# EAGLE design plugV17-Add-Large-Cap-to-support-RELAY-smd-5x5cm-side-button (EAGLE 7.6.0)
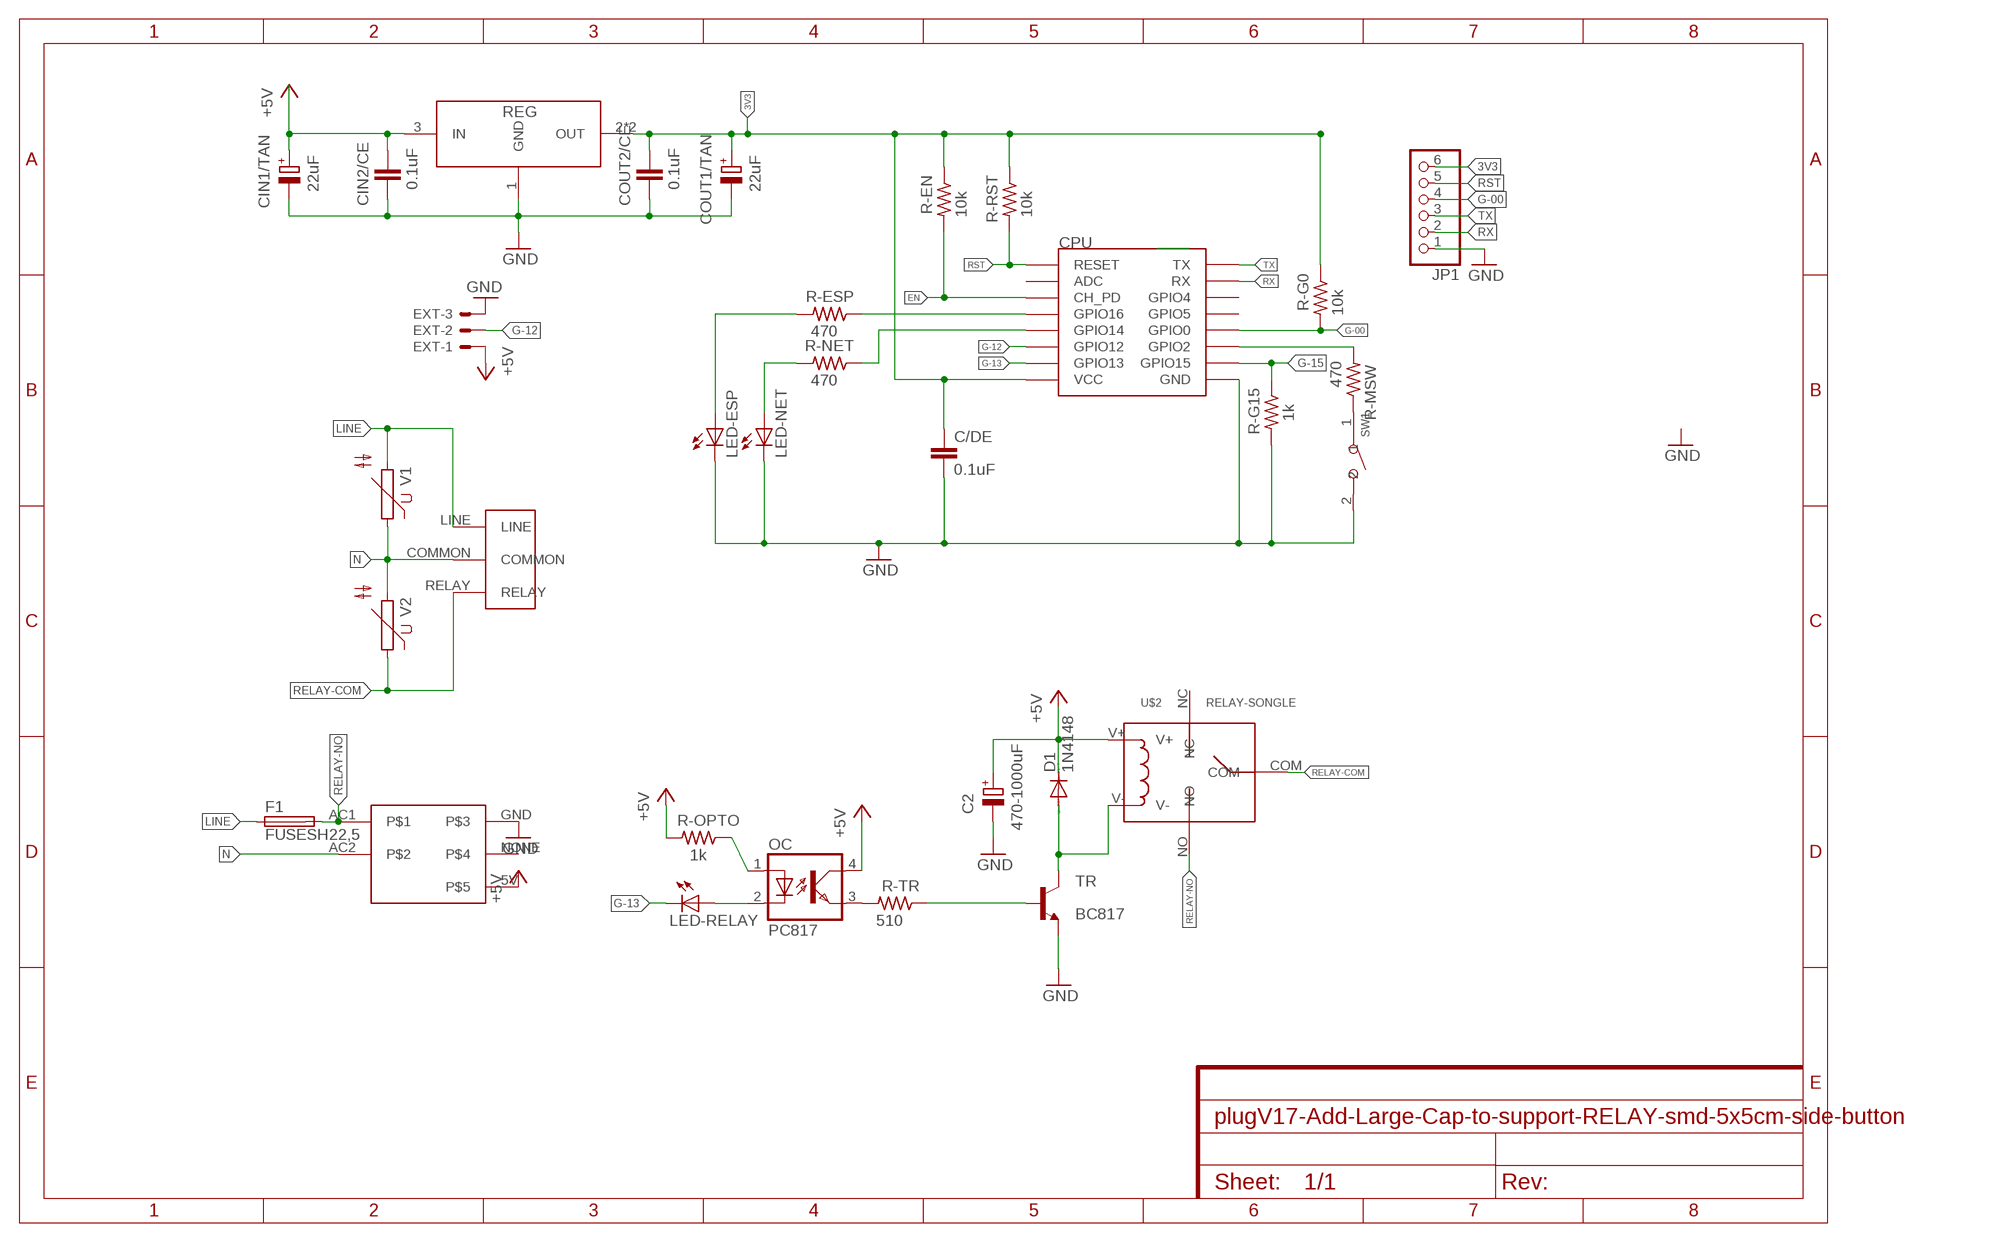
[diagram p0: schematic, sheet 1]

## Parts
C2  470-1000uF  CPOL-EUE3.5-8  [E3,5-8]
C/DE  0.1uF  C-EUC0805  [C0805]
CIN1/TAN  22uF  CPOL-EUB/3528-21R  [B/3528-21R]
CIN2/CE  0.1uF  C-EUC0805K  [C0805K]
COUT1/TAN  22uF  CPOL-EUB/3528-21R  [B/3528-21R]
COUT2/CE  0.1uF  C-EUC0805K  [C0805K]
CPU  ESP12SMD  [ESP12-SMD]
D1  1N4148  1N4148DO35-7  [DO35-7]
EXT  53048-03  [53048-03]
F1  FUSESH22,5  [SH22,5]
JP1  PINHD-1X6  [1X06]
LED-ESP  LEDCHIPLED_0805  [CHIPLED_0805]
LED-NET  LEDCHIPLED_0805  [CHIPLED_0805]
LED-RELAY  LEDCHIPLED_0805  [CHIPLED_0805]
OC  PC817  [DIL04]
R-EN  10k  R-US_M0805  [M0805]
R-ESP  470  R-US_M0805  [M0805]
R-G0  10k  R-US_M0805  [M0805]
R-G15  1k  R-US_M0805  [M0805]
R-MSW  470  R-US_M0805  [M0805]
R-NET  470  R-US_M0805  [M0805]
R-OPTO  1k  R-US_M0805  [M0805]
R-RST  10k  R-US_M0805  [M0805]
R-TR  510  R-US_M0805  [M0805]
REG  AMS1117-3.3  [SOT-223]
SW1  DIP-BUTTON(2P-6.0X3.0X4.3MM)-TS-1101F  [SW2-5.0-6.0X3.0X4.3MM]
TR  BC817  BC817-16SMD  [SOT23-BEC]
U$1  POWER-RELAY-FOOTPRINT  [POWER-RELAY-FOOTPRINT]
U$2  RELAY-SONGLE  [RELAY-SONGLE]
U$4  POWERSUPPLY-5V-700MA  [POWERSUPPLY-5V-700MA]
V1  S14K11  [S14K11]
V2  S14K11  [S14K11]

## Nets
3V3: C/DE.1 COUT1/TAN.+ COUT2/CE.1 CPU.VCC JP1.6 R-EN.1 R-G0.1 R-RST.1 REG.2(OUT) REG.4(OUT)
+5V: C2.+ CIN1/TAN.+ CIN2/CE.1 D1.C EXT.1 OC.4(COL) R-OPTO.2 REG.3(IN) U$2.V+ U$4.5V
EN: CPU.CH_PD R-EN.2
G-00: CPU.GPIO0 JP1.4 R-G0.2
G-12: CPU.GPIO12 EXT.2
G-13: CPU.GPIO13 LED-RELAY.C
G-15: CPU.GPIO15 R-G15.1
GND: C2.- C/DE.2 CIN1/TAN.- CIN2/CE.2 COUT1/TAN.- COUT2/CE.2 CPU.GND EXT.3 JP1.1 LED-ESP.C LED-NET.C R-G15.2 REG.1(GND) SW1.2 TR.E U$4.GND
LINE: F1.1 U$1.LINE V1.2
N: U$1.COMMON U$4.AC2 V1.1 V2.2
N$1: OC.3(EMIT) R-TR.2
N$2: R-TR.1 TR.B
N$6: LED-ESP.A R-ESP.2
N$7: CPU.GPIO2 R-MSW.2
N$8: CPU.GPIO14 R-NET.1
N$13: OC.1(A) R-OPTO.1
N$16: LED-NET.A R-NET.2
N$17: D1.A TR.C U$2.V-
N$19: CPU.GPIO16 R-ESP.1
N$21: LED-RELAY.A OC.2(C)
N$22: R-MSW.1 SW1.1
RELAY-COM: U$1.RELAY U$2.COM V2.1
RELAY-NO: F1.2 U$2.NO U$4.AC1
RST: CPU.RESET JP1.5 R-RST.2
RX: CPU.RXD0(RX) JP1.2
TX: CPU.TXD0(TX) JP1.3
Unconnected: CPU.ADC CPU.GPIO4 CPU.GPIO5 U$2.NC U$4.NONE

## Library data of the parts
C2 CIN1/TAN COUT1/TAN = rcl:CPOL-EU: POLARIZED CAPACITOR, European symbol
C/DE CIN2/CE COUT2/CE = rcl:C-EU: CAPACITOR, European symbol
CPU = esp8266modules:ESP12: ESP8266 Wifi module 12
D1 = diode:1N4148: DIODE high speed (Philips)
EXT = con-molex:53?-03: CONNECTOR wire to board 1.25 mm (.049 inch) pitch header; MF: WALDOM/MOLEX; MPN: 53048-0310; OC_FARNELL: 9732918; OC_NEWARK: 38C9908
F1 = fuse:FUSE: Fuse; OC_FARNELL: unknown; OC_NEWARK: unknown
JP1 = pinhead:PINHD-1X6: PIN HEADER
LED-ESP LED-NET LED-RELAY = led:LED: LED OSRAM: - CHIPLED LG R971, LG N971, LY N971, LG Q971, LY Q971, LO R971, LY R971 LH N974, LH R974 LS Q976, LO Q976, LY Q976 LO Q996 - Hyper CHIPLED LW Q18S LB Q993, LB Q99A, LB R99A - SideLED LS A670, LO A670, LY A670, LG A670, LP A670 LB A673, LV A673, LT A673, LW A673 LH A674 LY A675 LS A676, LA A676, LO A676, LY A676, LW A676 LS A679, LY A679, LG A679 - Hyper Micro SIDELED® LS Y876, LA Y876, LO Y876, LY Y876 LT Y87S - SmartLED LW L88C, LW L88S LB L89C, LB L89S, LG L890 LS L89K, LO L89K, LY L89K LS L896, LA L896, LO L896, LY L896 - TOPLED LS T670, LO T670, LY T670, LG T670, LP T670 LSG T670, LSP T670, LSY T670, LOP T670, LYG T670 LG T671, LOG T671, LSG T671 LB T673, LV T673, LT T673, LW T673 LH T674 LS T676, LA T676, LO T676, LY T676, LB T676, LH T676, LSB T676, LW T676 LB T67C, LV T67C, LT T67C, LS T67K, LO T67K, LY T67K, LW E67C LS E67B, LA E67B, LO E67B, LY E67B, LB E67C, LV E67C, LT E67C LW T67C LS T679, LY T679, LG T679 LS T770, LO T770, LY T770, LG T770, LP T770 LB T773, LV T773, LT T773, LW T773 LH T774 LS E675, LA E675, LY E675, LS T675 LS T776, LA T776, LO T776, LY T776, LB T776 LHGB T686 LT T68C, LB T68C - Hyper Mini TOPLED® LB M676 - Mini TOPLED Santana® LG M470 LS M47K, LO M47K, LY M47K Source: http://www.osram.convergy.de LUXEON: - LUMILED® LXK2-PW12-R00, LXK2-PW12-S00, LXK2-PW14-U00, LXK2-PW14-V00 LXK2-PM12-R00, LXK2-PM12-S00, LXK2-PM14-U00 LXK2-PE12-Q00, LXK2-PE12-R00, LXK2-PE12-S00, LXK2-PE14-T00, LXK2-PE14-U00 LXK2-PB12-K00, LXK2-PB12-L00, LXK2-PB12-M00, LXK2-PB14-N00, LXK2-PB14-P00, LXK2-PB14-Q00 LXK2-PR12-L00, LXK2-PR12-M00, LXK2-PR14-Q00, LXK2-PR14-R00 LXK2-PD12-Q00, LXK2-PD12-R00, LXK2-PD12-S00 LXK2-PH12-R00, LXK2-PH12-S00 LXK2-PL12-P00, LXK2-PL12-Q00, LXK2-PL12-R00 Source: www.luxeon.com KINGBRIGHT: KA-3528ASYC Source: www.kingbright.com
OC = optocoupler:PC817: SHARP OPTO COUPLER; MPN: PC817X4J000F; OC_FARNELL: 9707727; OC_NEWARK: 97K7059
R-EN R-ESP R-G0 R-G15 R-MSW R-NET R-OPTO R-RST R-TR = rcl:R-US_: RESISTOR, American symbol
REG = AMS1117-3.3:AMS1117-3.3: 1A LOW DROPOUT VOLTAGE REGULATOR
SW1 = Seeed-OPL-Switch:DIP-BUTTON(2P-6.0X3.0X4.3MM): 311020025
TR = transistor-npn:BC817*: NPN Transistor
U$1 = Power-Plug-Footprint:POWER-RELAY-FOOTPRINT
U$2 = Relay-Songle:RELAY-SONGLE
U$4 = PowerSupply-5V-700mA:POWERSUPPLY-5V-700MA
V1 V2 = varistor:S14K11: VARISTOR

## Board
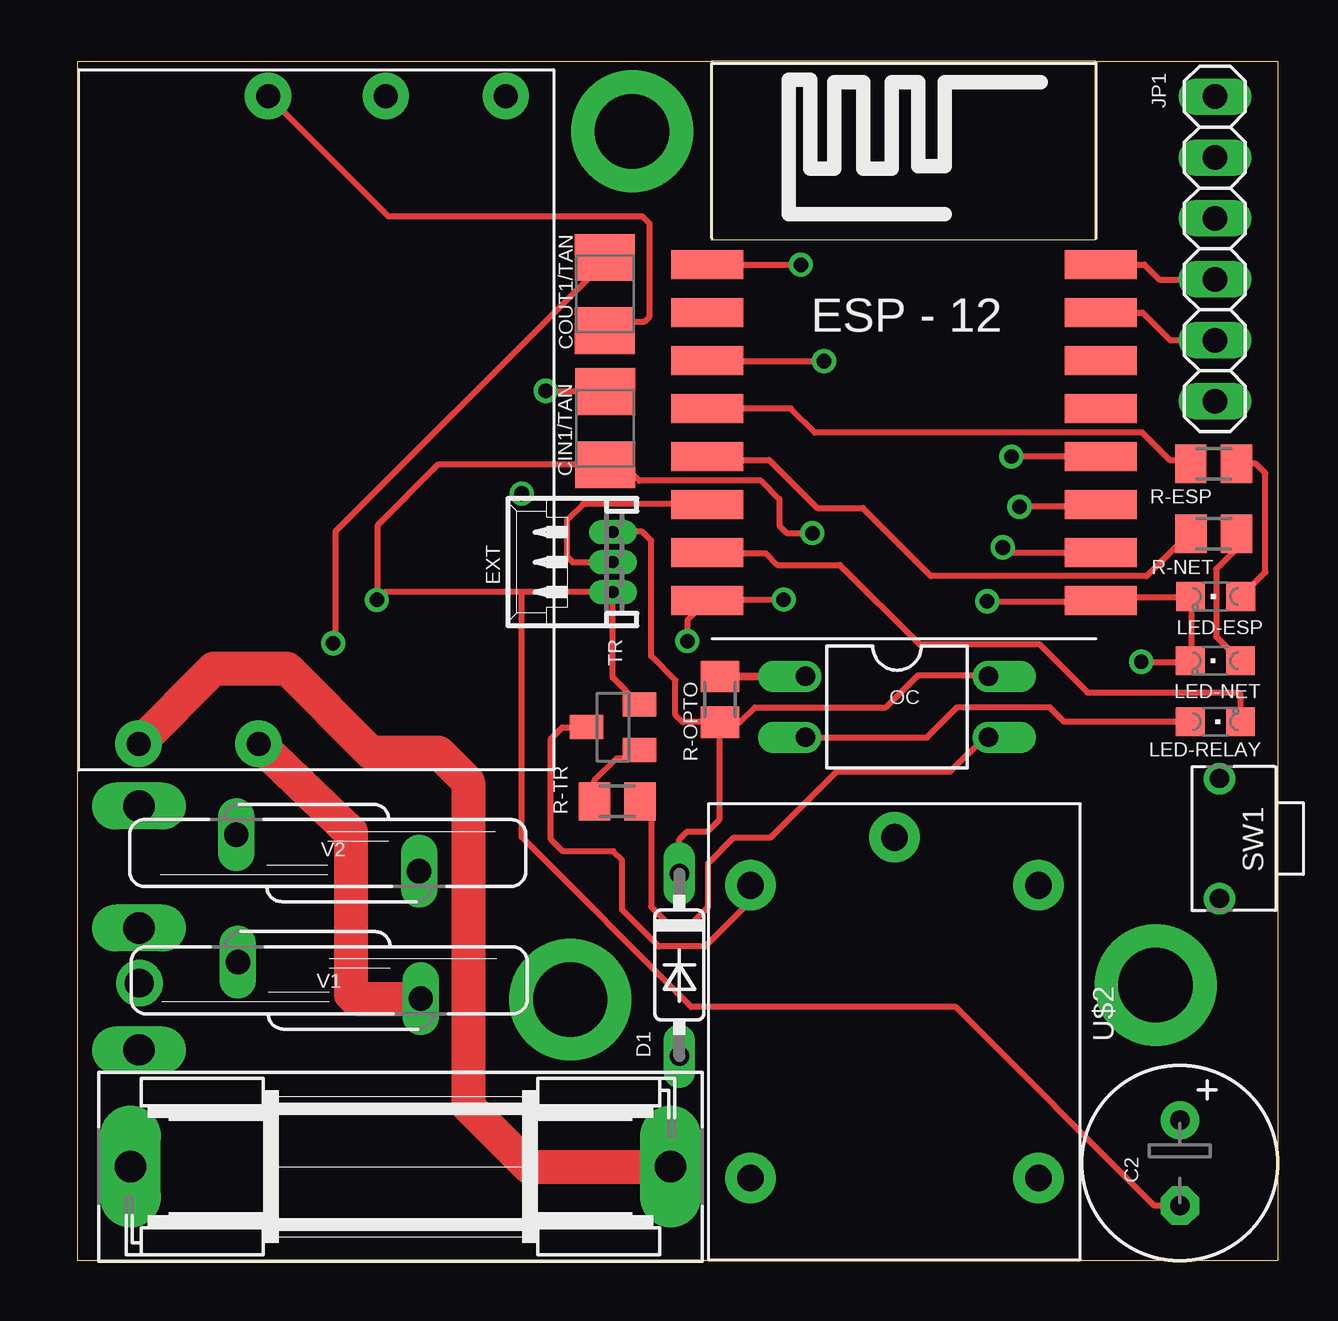
[diagram p1: board, top side]
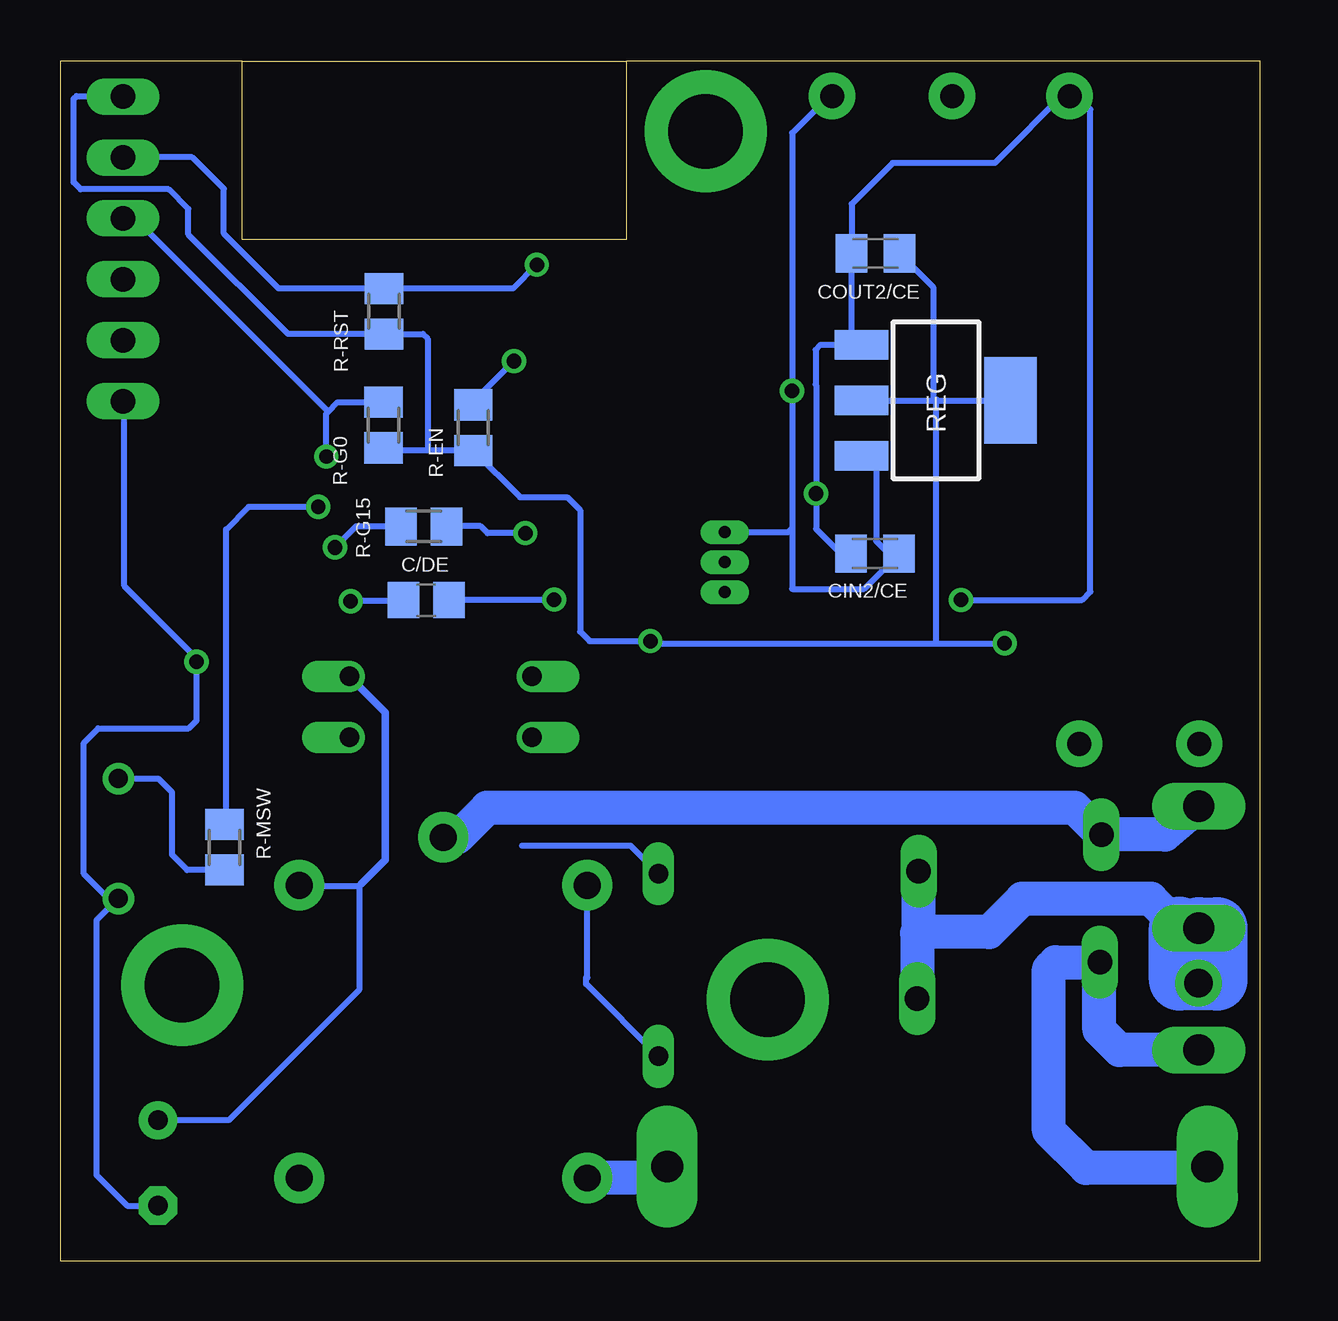
[diagram p2: board, bottom side, seen from below]

Size 50 x 50 mm. Coordinates in mm from the lower left corner, seen from the top.
Outline: 26.4,50 0,50 0,0 50,0 50,50 42.4,50
Outline: 26.4,50 26.4,42.55 42.4,42.55 42.4,50
Outline: 42.4,50 26.4,50
Copper layers (1*16): Top 0.035mm / dielectric 1.5mm / Bottom 0.035mm
Design rules "default": minimum track width 10mil, minimum drill 24mil, track to track 8mil, track to pad 8mil, pad to pad 8mil, via to via 8mil, smd to smd 8mil, copper to edge 40mil, drill to drill 8mil, minimum pad ring 10mil, minimum via ring 8mil, stop-mask expansion 4mil, vias tented up to drill 0mil, thermal gap 10mil

### Footprints (pad centres in the part's own frame; a part is rotated, then mirrored left to right if it is on the bottom)
E3,5-8 = drill 0.813 pad 1.6: + -1.778,0 | drill 0.813 pad 1.6 octagon: - 1.778,0
C0805 = smd 1.3 x 1.5: 1 -0.95,0; 2 0.95,0
B/3528-21R = smd 1.95 x 2.5: + 1.525,0; - -1.525,0
C0805K = smd 1.3 x 1.6: 1 -1,0; 2 1,0
ESP12-SMD = smd 3 x 1.2: ADC -8.3,3.8; CH_PD -8.3,1.8; GND 8.1,-8.2; GPIO0 8.1,-2.2; GPIO2 8.1,-4.2; GPIO4 8.1,1.8; GPIO5 8.1,-0.2; GPIO12 -8.3,-4.2; GPIO13 -8.3,-6.2; GPIO14 -8.3,-2.2; GPIO15 8.1,-6.2; GPIO16 -8.3,-0.2; RESET -8.3,5.8; RXD0 8.1,3.8; TXD0 8.1,5.8; VCC -8.3,-8.2
DO35-7 = drill 0.813 long: A 3.81,0; C -3.81,0
53048-03 = drill 0.5 pad 0.698 long: 1 1.25,-1.25; 2 0,-1.25; 3 -1.25,-1.25
SH22,5 = drill 1.321 pad 2.54 long: 1 -11.252,0; 2 11.252,0
1X06 = drill 1.016 long: 1 -6.35,0; 2 -3.81,0; 3 -1.27,0; 4 1.27,0; 5 3.81,0; 6 6.35,0
CHIPLED_0805 = smd 1.2 x 1.2: A 0,-1.05; C 0,1.05
DIL04 = drill 0.813 offset: 1 -1.27,-3.81; 2 1.27,-3.81; 3 1.27,3.81; 4 -1.27,3.81
M0805 = smd 1.3 x 1.6: 1 -0.95,0; 2 0.95,0
SOT-223 = smd 1.219 x 2.235: 1 -2.381,-3.099; 2 -0.07,-3.099; 3 2.241,-3.099 | smd 3.6 x 2.2: 4 -0.07,3.099
SW2-5.0-6.0X3.0X4.3MM = drill 0.8 pad 1.27: 1 -2.5,0; 2 2.5,0
SOT23-BEC = smd 1 x 1.4: B -0.95,-1.1; C 0,1.1; E 0.95,-1.1
POWER-RELAY-FOOTPRINT = drill 1.3 long: COMMON 0,0; LINE -5.08,0; RELAY 5.08,0
RELAY-SONGLE = drill 1.118 pad 2.1: COM -8.1,0; NC 6.1,6; NO 6.1,-6; V+ -6.1,6; V- -6.1,-6
POWERSUPPLY-5V-700MA = drill 1 pad 1.93: 5V 13.5,-7.9; AC1 -13.5,7.4; AC2 -13.5,2.4; GND 13.5,2; NONE 13.5,-2.9
S14K11 = drill 1.016 long: 1 -0.762,-3.81; 2 0.762,3.81

### Placement (x,y rotation side)
C2  45.92,4.07 270 top
C/DE  34.74,27.53 180 bottom
CIN1/TAN  21.97,34.69 90 top
CIN2/CE  16.04,29.47 180 bottom
COUT1/TAN  21.96,40.29 90 top
COUT2/CE  16.02,41.98 180 bottom
CPU  34.52,35.71 0 top
D1  25.07,12.32 270 top
EXT  21.05,29.12 90 top
F1  13.45,3.92 0 top
JP1  47.38,42.17 90 top
LED-ESP  47.41,27.68 90 top
LED-NET  47.4,25 90 top
LED-RELAY  47.4,22.46 270 top
OC  34.14,23.08 270 top
R-EN  32.78,34.72 90 bottom
R-ESP  47.33,33.22 0 top
R-G0  36.52,34.83 90 bottom
R-G15  34.84,30.6 0 bottom
R-MSW  43.15,17.23 90 bottom
R-NET  47.33,30.29 0 top
R-OPTO  26.75,23.39 270 top
R-RST  36.49,39.57 90 bottom
R-TR  22.48,19.14 0 top
REG  13.5,35.78 270 bottom
SW1  47.57,17.59 270 top
TR  22.3,22.24 90 top
U$1  2.55,13.86 90 top
U$2  34.03,9.54 270 top
U$4  9.93,35.04 90 top
V1  10.48,11.68 90 top
V2  10.41,16.99 270 top

### Tracks (layer width: path | path; a pad name or v marks a point on that pad's centre or on a via)
3V3  (via drill 0.6)
  Top 0.254: v29.41,27.55 26.26,27.55 CPU.VCC 25.4,26.69 v25.4,25.82 | COUT1/TAN.+ 21.95,41.6 10.74,30.4 10.74,25.83 v10.64,25.73
  Bottom 0.254: v29.41,27.55 29.43,27.53 C/DE.1 | REG.2 13.62,35.85 | 13.62,35.85 13.49,35.85 | 13.49,35.85 REG.4 | COUT2/CE.1 13.62,40.58 13.62,35.85 | 34.71,33.77 R-EN.1 30.83,31.82 28.87,31.82 28.33,31.28 28.33,26.22 27.93,25.82 v25.4,25.82 25.22,25.64 25.13,25.73 13.49,25.73 | 34.71,33.77 36.41,33.77 R-G0.1 | 34.71,33.77 34.68,33.8 34.68,38.42 34.88,38.62 R-RST.1 40.5,38.62 44.65,42.77 44.65,43.83 45.47,44.65 49.14,44.65 49.43,44.94 49.43,48.42 49.31,48.54 47.4,48.54 JP1.6 | 13.49,25.73 v10.64,25.73 | 13.49,25.73 13.49,35.85 | 13.49,35.89 13.49,35.85
+5V  (via drill 0.61)
  Top 0.254: R-OPTO.2 27.6,22.44 28.22,23.06 33.67,23.06 35.01,24.4 37.9,24.4 OC.4 | R-OPTO.2 25.21,22.44 24.9,22.75 24.9,24.18 23.89,25.19 23.89,30.02 23.53,30.38 22.31,30.38 EXT.1 | D1.C 25.07,17.56 25.39,17.88 26.24,17.88 26.74,18.38 26.74,22.43 R-OPTO.2 | v19.5,36.25 21.75,36.25 CIN1/TAN.+
  Bottom 0.254: REG.3 16.5,33.5 16,33 16,30 15.5,29.5 CIN2/CE.1 15.5,29 16.5,28 19.5,28 19.5,30.53 | 19.5,30.53 v19.5,36.25 19.5,47 17.96,48.54 U$4.5V | C2.+ 42.97,5.85 37.54,11.28 37.54,15.6 | EXT.1 19.66,30.37 19.5,30.53 | D1.C 26.22,17.29 30.76,17.29 | 37.45,15.69 37.54,15.6 | 37.54,15.6 39.99,15.6 U$2.V+
  Bottom 0.305: OC.4 36.44,22.84 36.44,16.7 37.45,15.69
EN  (via drill 0.61)
  Top 0.254: v31.09,37.49 26.29,37.49 CPU.CH_PD
  Bottom 0.254: v31.09,37.49 32.69,35.89 R-EN.2
G-00  (via drill 0.6)
  Top 0.254: CPU.GPIO0 v38.9,33.51
  Bottom 0.254: 38.83,35.4 38.9,35.32 v38.9,33.51 38.88,33.49 | 38.83,35.4 38.44,35.78 R-G0.2 | 38.83,35.4 46.86,43.43 47.32,43.43 JP1.4
G-12
  Top 0.254: CPU.GPIO12 26.2,31.54 21.06,31.54 20.38,30.86 20.38,29.36 20.62,29.12 EXT.2
G-13
  Top 0.254: LED-RELAY.C 48.44,23.6 48.37,23.67 42.08,23.67 40.06,25.69 35.06,25.69 31.75,29 29.15,29 28.66,29.49 26.29,29.49 CPU.GPIO13
G-15  (via drill 0.61)
  Top 0.254: v38.54,29.72 38.75,29.51 CPU.GPIO15
  Bottom 0.254: R-G15.1 37.67,30.6 v38.54,29.72
GND  (via drill 0.6, 0.61)
  Top 0.254: v37.89,27.48 42.59,27.48 CPU.GND 42.75,27.66 46.18,27.66 LED-ESP.C 46.41,27.66 46.41,25.15 LED-NET.C 46.31,24.96 v44.31,24.96 | v30.61,30.32 29.55,30.32 29.23,30.64 29.23,31.75 28.47,32.51 23.41,32.51 22.75,33.16 CIN1/TAN.- 21.95,33.19 15.03,33.19 12.51,30.66 12.51,27.59 v12.46,27.54 12.79,27.87 18.49,27.87 | 18.49,27.87 EXT.3 22.29,27.86 22.29,24.3 TR.E | COUT1/TAN.- 21.84,39.14 23.62,39.14 23.83,39.35 23.83,43.23 23.54,43.52 12.96,43.52 U$4.GND | C2.- 44.86,2.29 36.58,10.57 25.57,10.57 18.49,17.65 18.49,27.87
  Bottom 0.254: C/DE.2 35.5,27.5 37.87,27.5 v37.89,27.48 | CIN2/CE.2 17.5,29.5 18.5,30.5 v18.5,31.97 18.5,36.5 18.52,36.52 18.52,37.96 18.32,38.16 REG.1 17.02,38.59 COUT2/CE.2 | 17,42 COUT2/CE.2 | v12.46,27.54 7.41,27.54 7.07,27.88 7.07,47.98 U$4.GND 8.03,48.77 11.05,45.75 15.31,45.75 17.02,44.04 COUT2/CE.2 | v30.61,30.32 32.18,30.32 32.47,30.61 33.88,30.61 R-G15.2 | JP1.1 47.32,35.66 47.32,28.12 44.35,25.15 v44.31,24.96 44.31,22.51 44.64,22.18 48.41,22.18 49.01,21.58 49.01,16.12 47.98,15.09 SW1.2 48.48,14.18 48.48,3.57 47.2,2.29 C2.-
LINE
  Bottom 1.422: F1.1 1.96,3.86 7.25,3.86 8.8,5.41 8.8,12.15 8.52,12.43 6.68,12.43 V1.2 6.69,12.42 6.69,9.61 5.86,8.78 U$1.LINE
N
  Top 1.422: U$4.AC2 11.38,17.86 11.38,11.1 11.56,10.92 V1.1
  Bottom 1.422: 3.36,13.89 4.55,15.08 9.91,15.08 11.29,13.7 14.24,13.7 | 14.24,13.7 14.29,13.65 V1.1 | V2.2 14.24,16.21 14.24,13.7
  Bottom 2.54: U$1.COMMON 1.8,13.87 1.8,11.7 3.36,11.7 3.36,13.89
N$1
  Top 0.254: R-TR.2 23.89,18.68 23.89,14.75 24.52,14.12 25.65,14.12 26.27,14.74 26.27,16.56 27.34,17.63 28.87,17.63 31.62,20.38 36.35,20.38 37.78,21.81 OC.3
N$2
  Top 0.254: R-TR.1 21.53,20.01 22.47,20.95 23.07,20.95 TR.B
N$3  (via drill 3.1 pad 5.08)
  other vias: 20.52,10.88
N$6
  Top 0.254: LED-ESP.A 49.48,28.7 49.48,32.82 49.08,33.22 R-ESP.2
N$7  (via drill 0.6)
  Top 0.254: CPU.GPIO2 42.53,31.42 v39.24,31.42
  Bottom 0.254: R-MSW.2 43.08,18.25 43.08,30.48 42.14,31.42 v39.24,31.42
N$8
  Top 0.254: R-NET.1 46.18,30.18 44.53,28.53 35.55,28.53 32.71,31.37 30.81,31.37 28.8,33.38 26.29,33.38 CPU.GPIO14
N$9  (via drill 3.1 pad 5.08)
  other vias: 44.91,11.48
N$13
  Top 0.305: R-OPTO.1 26.77,24.35 OC.1
N$16
  Top 0.254: R-NET.2 48.28,29.67 47.43,28.82 47.43,26.02 LED-NET.A
N$17
  Top 0.254: TR.C 20.19,22.23 19.71,21.75 19.71,17.56 20.21,17.06 22.32,17.06 22.68,16.7 22.68,14.62 24.21,13.09 26.15,13.09 28.03,14.97 U$2.V-
  Bottom 0.254: D1.A 28.08,11.53 28.08,11.79 28.03,11.79 U$2.V-
N$18  (via drill 3.1 pad 5.08)
  other vias: 23.1,47.07
N$19
  Top 0.254: R-ESP.1 46.18,33.38 45.49,33.38 44.35,34.52 30.72,34.52 30.72,34.51 29.72,35.51 CPU.GPIO16
N$20  (via drill 1.2 pad 1.93)
  other vias: 2.57,11.56
N$21
  Top 0.254: OC.2 35.38,21.8 36.65,23.07 36.66,23.06 40.5,23.06 41.1,22.46 LED-RELAY.A
N$22
  Bottom 0.254: R-MSW.1 44.7,16.28 45.33,16.91 45.33,19.52 45.89,20.08 SW1.1
RELAY-COM
  Bottom 1.422: U$1.RELAY 3.96,17.75 V2.1 7.72,18.87 32.2,18.87 33.43,17.64 U$2.COM
RELAY-NO
  Top 1.422: F1.2 18.78,3.92 16.27,6.43 16.27,19.94 15.04,21.17 12.35,21.17 12.32,21.2 12.19,21.2 8.72,24.67 5.66,24.67 U$4.AC1
  Bottom 1.422: F1.2 25.18,3.44 U$2.NO
RST  (via drill 0.6)
  Top 0.254: CPU.RESET v30.13,41.51
  Bottom 0.254: JP1.5 44.49,45.99 43.17,44.67 43.17,42.8 40.89,40.52 R-RST.2 31.12,40.52 v30.13,41.51
RX
  Top 0.254: CPU.RXD0 44.37,39.51 45.51,38.37 JP1.2
TX
  Top 0.254: CPU.TXD0 44.45,41.51 45.07,40.89 JP1.3